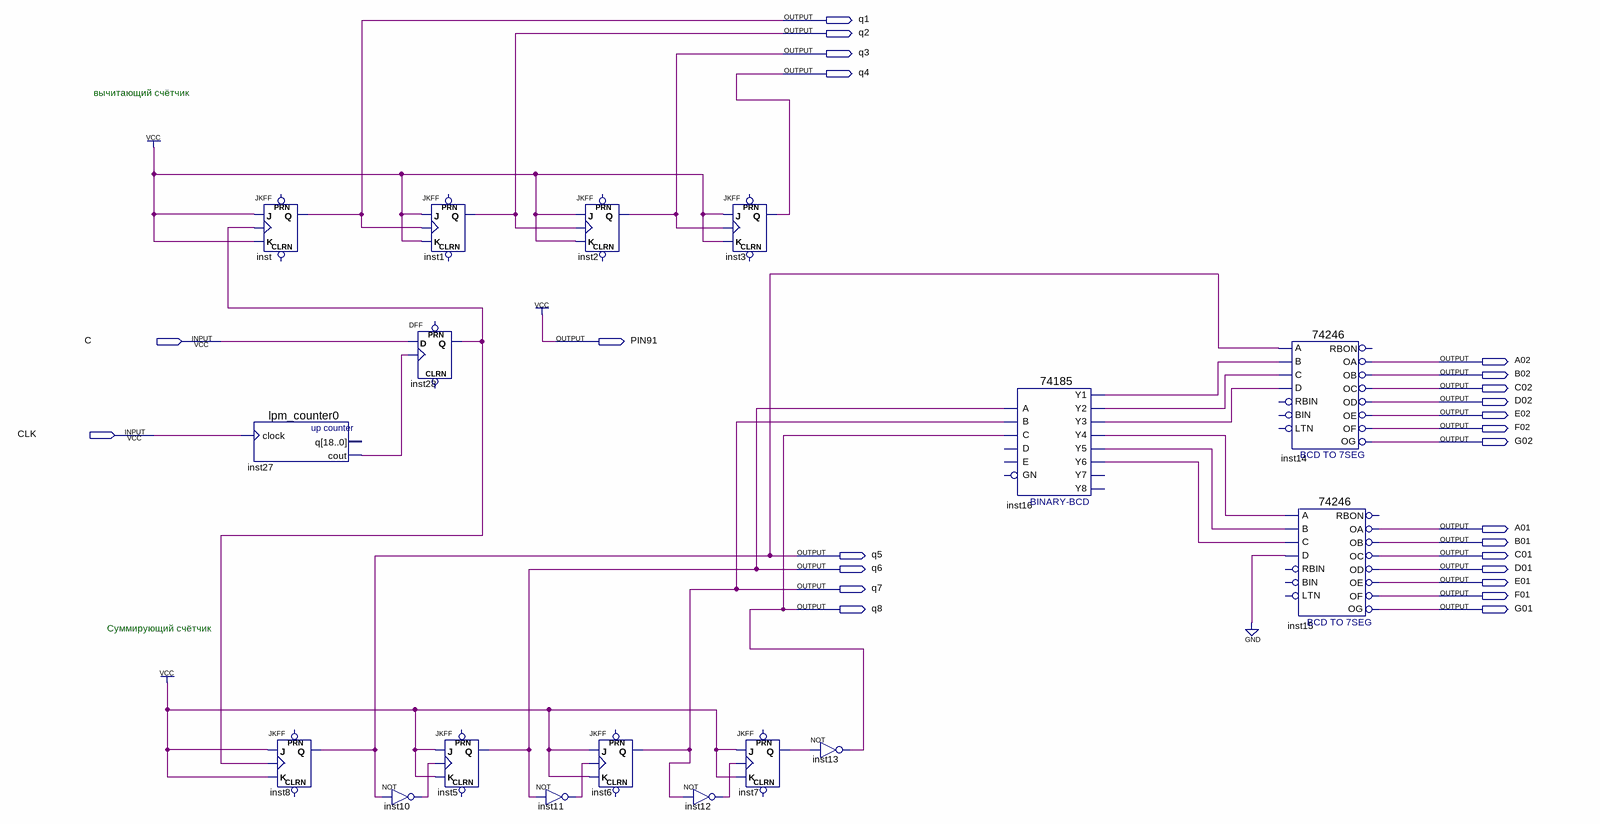
[diagram p0: schematic sheet]
// Quartus schematic counters.bdf as structural Verilog: 17 symbols, 25 pins
module counters (
  input  C,
  input  CLK,
  output q1,
  output q2,
  output q3,
  output q4,
  output PIN91,
  output A02,
  output B02,
  output C02,
  output D02,
  output E02,
  output F02,
  output G02,
  output A01,
  output B01,
  output q5,
  output C01,
  output q6,
  output D01,
  output E01,
  output q7,
  output F01,
  output q8,
  output G01
);

  wire inst7_q, inst10_out, inst11_out, inst12_out, inst16_y1, inst16_y2, inst16_y3, inst16_y4, inst16_y5,
       inst16_y6, inst27_cout, inst28_q;

  JKFF inst (.K(1'b1), .J(1'b1), .CLK(inst28_q), .Q(q1));  // open: PRN, CLRN
  lpm_counter0 inst27 (.clock(CLK), .cout(inst27_cout));  // open: q
  JKFF inst8 (.K(1'b1), .J(1'b1), .CLK(inst28_q), .Q(q5));  // open: PRN, CLRN
  not inst10 (inst10_out, q5);
  JKFF inst1 (.K(1'b1), .J(1'b1), .CLK(q1), .Q(q2));  // open: PRN, CLRN
  DFF inst28 (.CLK(inst27_cout), .D(C), .Q(inst28_q));  // open: CLRN, PRN
  JKFF inst5 (.K(1'b1), .J(1'b1), .CLK(inst10_out), .Q(q6));  // open: PRN, CLRN
  not inst11 (inst11_out, q6);
  JKFF inst2 (.K(1'b1), .J(1'b1), .CLK(q2), .Q(q3));  // open: PRN, CLRN
  JKFF inst6 (.K(1'b1), .J(1'b1), .CLK(inst11_out), .Q(q7));  // open: PRN, CLRN
  not inst12 (inst12_out, q7);
  JKFF inst3 (.K(1'b1), .J(1'b1), .CLK(q3), .Q(q4));  // open: PRN, CLRN
  JKFF inst7 (.K(1'b1), .J(1'b1), .CLK(inst12_out), .Q(inst7_q));  // open: PRN, CLRN
  not inst13 (q8, inst7_q);
  \74185  inst16 (
    .A(q6), .B(q7), .C(q8), .Y1(inst16_y1), .Y3(inst16_y3), .Y2(inst16_y2), .Y5(inst16_y5), .Y4(inst16_y4),
    .Y6(inst16_y6));  // open: D, E, GN, Y8, Y7
  \74246  inst14 (
    .B(inst16_y1), .A(q5), .D(inst16_y3), .C(inst16_y2), .OD(D02), .OC(C02), .OB(B02), .OE(E02), .OF(F02),
    .OA(A02), .OG(G02));  // open: RBIN, LTN, BIN, RBON
  \74246  inst15 (
    .B(inst16_y5), .A(inst16_y4), .D(1'b0), .C(inst16_y6), .OD(D01), .OC(C01), .OB(B01), .OE(E01), .OF(F01),
    .OA(A01), .OG(G01));  // open: RBIN, LTN, BIN, RBON

  assign PIN91 = 1'b1;

  // Notes on the sheet:
  //   вычитающий счётчик
  //   Суммирующий счётчик
endmodule
